# Altium project esb-25.PrjPcb
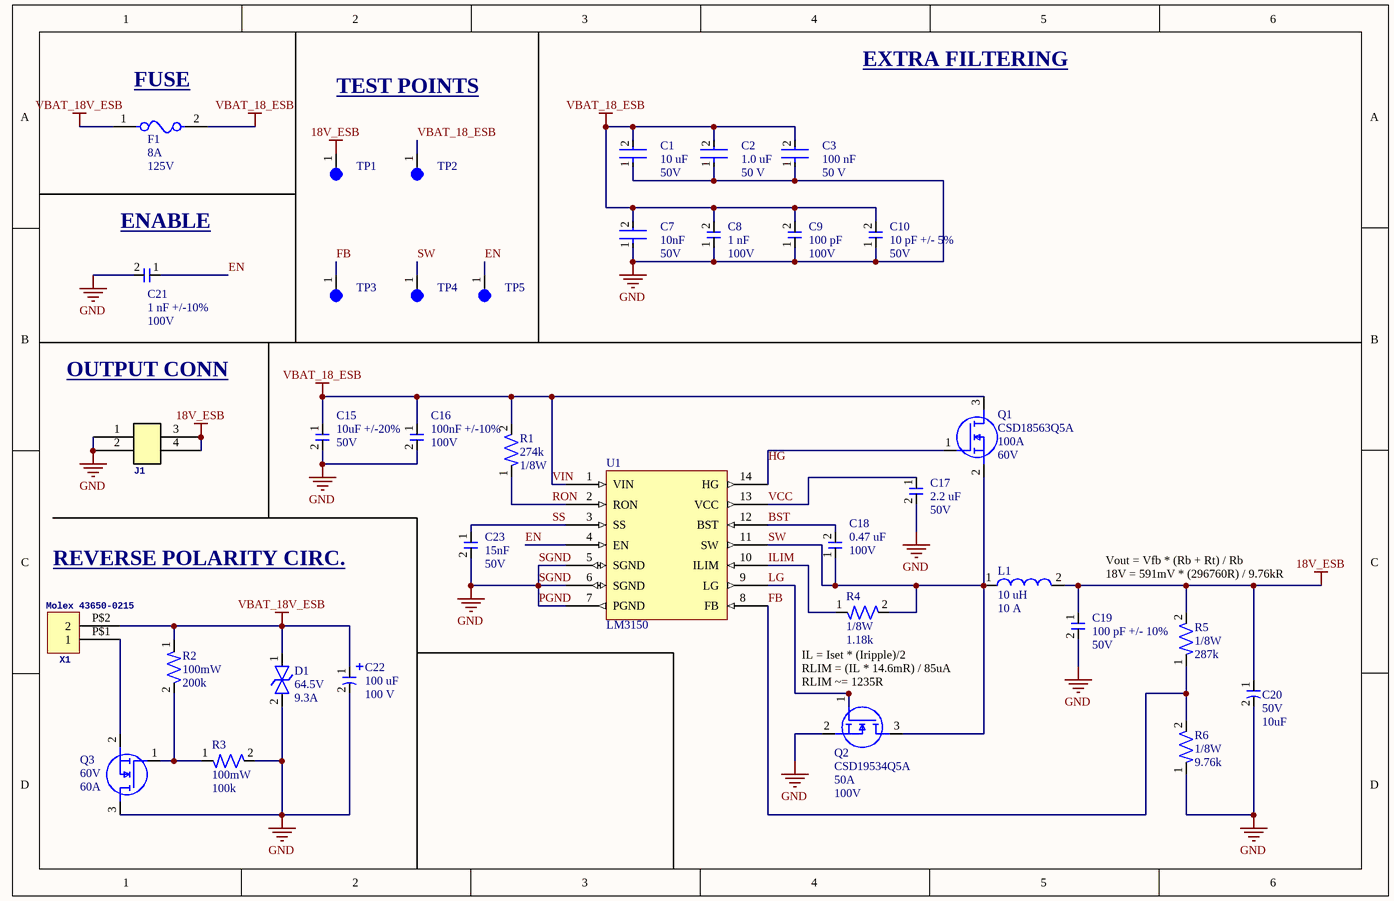
[diagram p0: 18V_ESB.SchDoc]
1 sheet, 36 parts. Net scope: global (net labels, ports and power ports of the same name join across sheets).
Board file: PCB1.PcbDoc

## Sheet 18V_ESB.SchDoc
size 259 x 167 mm; SheetNumber: 1; SheetTotal: 1

### Parts
C1  Voltage: 50V  Capacitance: 10 uF  [CAP-1210]  (hidden comment: CL32B106KBJNNNE)
C2  Voltage: 50 V  Capacitance: 1.0 uF  [CAP-0805]  (hidden comment: CC0805KKX7R9BB105)
C3  Voltage Rating: 50 V  Capacitance: 100 nF  [CAP-0805]  (hidden comment: CC0805KRX7R9BB104)
C7  Voltage: 50V  Capacitance: 10nF  [CAP-0805]  (hidden comment: GRM2195C1H103JA01D)
C8  Capacitance: 1 nF  Voltage Rating: 100V  [CAP-0805]  (hidden comment: CDR01BX102BKUS7185)
C9  Capacitance: 100 pF  Voltage: 100V  [CAP-0603]  (hidden comment: 0603N101J101CT)
C10  Capacitance: 10 pF +/- 5%  Voltage Rating: 50V  [CAP-0603]  (hidden comment: 0603N100J500CT)
C15  Capacitance: 10uF +/-20%  Voltage Rating: 50V  [CAP-1206]  (hidden comment: CL31B106KBHNNNE)
C16  Capacitance: 100nF +/-10%  Voltage Rating: 100V  [CAP-0603]  (hidden comment: CC0603KRX7R0BB104)
C17  Capacitance: 2.2 uF  oltage: 50V  [CAP-0603]  (hidden comment: UMK107BBJ225KA-T)
C18  Capacitance: 0.47 uF  Voltage: 100V  [CAP-0805]  (hidden comment: KAM21KR72A474KL)
C19  Capacitance: 100 pF +/- 10%  Voltage: 50V  [CAP-0402]  (hidden comment: 0402B101K500NT)
C20  Voltage: 50V  Capacitance: 10uF  [ELEC-10uF]  (hidden comment: EEE-FK1H100UR)
C21  Capacitance: 1 nF +/-10%  Voltage: 100V  [CAP-0603]  (hidden comment: C0603Y102K1RAC7867)
C22  Capacitance: 100 uF  Voltage: 100 V  [ELEC-100U-0001]  (hidden comment: 100SEV100M12.5X16)
C23  Parameter 1: 15nF  Parameter 2: 50V  [CAP-0402]  (hidden comment: CC0402JRX7R9BB153)
D1  Voltage Rating: 64.5V  Current Rating: 9.3A  [DO-214AA (SMBJ)]  (hidden comment: SMBJ40CA)
F1  Fuse Current: 8A  Voltage Rating: 125V  [FUSE-0001]  (hidden comment: 01550900M)
J1  Molex 43045-0412  [CONN-4POS-0002]  (value not drawn)
L1  Inductance: 10 uH  DCI: 10 A  [PWRIND-10U-0002]  (hidden comment: SRP1270-100M)
Q1  CSD18563Q5A  Id-Continuous: 100A  VDS-Max: 60V  [8-VSONP]
Q2  CSD19534Q5A  Id-Continuous: 50A  VDS-Max: 100V  [8-VSONP]
Q3  Voltage: 60V  Continuous Current: 60A  [IC-8VSONCLIP]  (hidden comment: CSD18543Q3AT)
R1  Resistance: 274k  Power: 1/8W  [RES-0805]  (hidden comment: RC0805FR-07274KL)
R2  Power: 100mW  Resistance: 200k  [RES-0603]  (hidden comment: RC0603FR-07200KL)
R3  Power: 100mW  Resistance: 100k  [RES-0603]  (hidden comment: RC0603FR-07100KL)
R4  Power: 1/8W  Resistance: 1.18k  [RES-0805]  (hidden comment: RC0805FR-071K18L)
R5  Power: 1/8W  Resistance: 287k  [RES-0805]  (hidden comment: RC0805FR-07287KL)
R6  Power: 1/8W  Resistance: 9.76k  [RES-0805]  (hidden comment: RC0805FR-079K76L)
TP1  5003  [TEST-POINT-0001]  (value not drawn)
TP2  5003  [TEST-POINT-0001]  (value not drawn)
TP3  5003  [TEST-POINT-0001]  (value not drawn)
TP4  5003  [TEST-POINT-0001]  (value not drawn)
TP5  5003  [TEST-POINT-0001]  (value not drawn)
U1  LM3150  [IC-14HTSSOP]
X1  Molex 43650-0215  [43650-0215]

### Nets
18V_ESB: C19.1 C20.1 J1.3 J1.4 L1.2 R5.2 TP1.1
PGND: C1.1 C2.1 C3.1 C7.1 C8.1 C9.1 C10.1 C15.2 C16.2 C17.2 C19.2 C20.2 C21.2 C22.2 C23.2 D1.2 J1.1 J1.2 Q2.2(S) Q3.3(D) R3.2 R6.1 U1.5(SGND) U1.6(SGND) U1.7(PGND)  [also labelled GND, SGND]
VBAT_18_ESB: C1.2 C2.2 C3.2 C7.2 C8.2 C9.2 C10.2 C15.1 C16.1 F1.2 Q1.3(D) R1.2 TP2.1 U1.1(VIN)  [also labelled VIN]
VBAT_18V_ESB: C22.1 D1.1 F1.1 R2.1 X1.P$2(2)
BST: C18.2 U1.12(BST)
EN: C21.1 TP5.1 U1.4(EN)
FB: R5.1 R6.2 TP3.1 U1.8(FB)
HG: Q1.1(G) U1.14(HG)
ILIM: R4.1 U1.10(ILIM)
LG: Q2.1(G) U1.9(LG)
RON: R1.1 U1.2(RON)
SS: C23.1 U1.3(SS)
SW: C18.1 L1.1 Q1.2(S) Q2.3(D) R4.2 TP4.1 U1.11(SW)
VCC: C17.1 U1.13(VCC)
NetQ3_1: Q3.1(G) R2.2 R3.1
NetQ3_2: Q3.2(S) X1.P$1(1)

### Notes on the sheet
- (near F1) FUSE
- TEST POINTS
- EXTRA FILTERING
- (near C21) ENABLE
- OUTPUT CONN
- REVERSE POLARITY CIRC.
- (near R5) Vout = Vfb * (Rb + Rt) / Rb
  18V = 591mV * (296760R) / 9.76kR
- (near Q2) IL = Iset * (Iripple)/2
  RLIM = (IL * 14.6mR) / 85uA
  RLIM ~= 1235R

### Library data of the parts
C1 = CAP-10U-0002: CAP CER 10UF 50V X7R 1210; Device Class: Ceramic; Size: 1210; ComponentLink1Description: Datasheet; ComponentLink1URL: https://mm.digikey.com/Volume0/opasdata/d220001/medias/docus/41/CL32B106KBJNNNE_Spec.pdf
C2 = CAP-1U-0001: CAP CER 1UF 50V X7R 0805; ComponentLink2URL: https://www.yageo.com/upload/media/product/productsearch/datasheet/mlcc/UPY-GPHC_X7R_6.3V-to-250V_24.pdf; ComponentLink2Description: Datasheet; Device Class: Ceramic; Size: 0805
C3 = CAP-0.1U-0002: CAP CER 0.1UF 50V X7R 0805; ComponentLink2Description: Datasheet; ComponentLink2URL: https://www.yageo.com/upload/media/product/productsearch/datasheet/mlcc/UPY-GPHC_X7R_6.3V-to-250V_24.pdf; Device Class: Ceramic; Size: 0805
C7 = CAP-10N-0001: CAP CER 10000PF 50V C0G/NP0 0805; Device Class: Ceramic; Size: 0805; ComponentLink1Description: Datasheet; ComponentLink1URL: https://search.murata.co.jp/Ceramy/image/img/A01X/G101/ENG/GRM2195C1H103JA01-01.pdf
C8 = CAP-1N-0003: 1000 pF ±10% 100V Ceramic Capacitor BX 0805 (2012 Metric); Package Size: 0805
C9 = CAP-100P-0002: 100 pF ±5% 100V Ceramic Capacitor C0G, NP0 0603 (1608 Metric); Tolerance: +/-5%; Temp Coeff: C0G/NP0; Package Size: 0603
C10 = CAP-10P-0001: 10 pF ±5% 50V Ceramic Capacitor C0G, NP0 0603 (1608 Metric); Manufacturer: Walshin Technology Corporation; Assembled?: Yes; Manufacturer Part Number: 0603N100J500CT; Temperature Coefficient: C0G, NP0; Package Size: 0603
C15 = CAP-10U-0001: 10 µF ±10% 50V Ceramic Capacitor X7R 1206 (3216 Metric); Manufacturer: Samsung Electro-Mechanics; Assembled?: no; Manufacturer Part Number: CL31B106KBHNNNE; Temperature Coefficient: X7R; Package Size: 1206
C16 = CAP-100N-0001: CAP CER 0.1UF 100V X7R 0603; Manufacturer: YAGEO; Assembled?: no; Manufacturer Part Number: CC0603KRX7R0BB104; Temperature Coefficient: X7R; Package Size: 0603
C17 = CAP-2.2U-0001: 2.2 µF ±10% 50V Ceramic Capacitor X5R 0603 (1608 Metric)
C18 = CAP-0.47U-0001: 0.47 µF ±10% 100V Ceramic Capacitor X7R 0805 (2012 Metric); Tolerance: +/- 10%; Assembled?: No; Temperature Coefficient: X7R; Package Size: 0805
C19 = CAP-100P-0001-JLC: 50V 100pF X7R ±10% 0402 Multilayer Ceramic Capacitors MLCC - SMD/SMT ROHS; assembled?: yes; JLC part number: C2991538
C20 = ELEC-10U-0001: 10 µF 50 V Aluminum Electrolytic Capacitors Radial, Can - SMD 2000 Hrs @ 105°C; Manufacturer Part Number: RC0402FR-074K7P; Manufacturer: YAGEO; Assembled?: no; Package Size: 0402
C21 = CAP-1N-0001: 1000 pF ±10% 100V Ceramic Capacitor X7R 0603 (1608 Metric)
C22 = ELEC-100U-0001: 100 µF 100 V Aluminum Electrolytic Capacitors Radial, Can - SMD 2000 Hrs @ 85°C; Manufacturer: Rubycon; Tolerance: +/- 20%; Assembled?: No; ESR: idk check the datasheet i couldnt find it
C23 = CAP-15N-0001: CAP CER 0.015UF 50V X7R 0402
D1 = DIO-TVS-0001: TVS DIODE 40VWM 64.5VC DO214AA; ComponentLink1Description: Datasheet; ComponentLink1URL: https://www.littelfuse.com/media?resourcetype=datasheets&itemid=09a6ae9a-73cb-4ac4-acac-e6dab92ab953&filename=littelfuse_tvs_diode_smbj_datasheet.pdf
F1 = FUSE-0001: FUSE BLOK CARTRIDGE 125V 10A SMD; ComponentLink2Description: Datasheet; ComponentLink2URL: https://www.littelfuse.com/~/media/electronics/datasheets/fuses/littelfuse_fuse_154_154t_154l_154tl_datasheet.pdf.pdf
J1 = CONN-4POS-0002: CONN HEADER VERT 4POS 3MM; ComponentLink1Description: Datasheet; ComponentLink1URL: https://www.molex.com/content/dam/molex/molex-dot-com/products/automated/en-us/salesdrawingpdf/430/43045/430450412_sd.pdf?inline
L1 = PWRIND-10U-0002: 10 µH Shielded Drum Core, Wirewound Inductor 10 A 16.8mOhm Max Nonstandard; Tolerance: +/- 20%; Isat: 16A; Assembled?: No; DCR: 16.8 mOhm
Q1 = NMOS-100A-0001: MOSFET N-CH 60V 100A 8VSON; Manufacturer Part Number: T2N7002AK,LM; Manufacturer: Toshiba; FET type: N-Channel; Rds On-Max: 3.9Ohm; Vgs-Max: 20V; Assembled?: no; Package: SOT-23-3
Q2 = NMOS-50A-0001: MOSFET N-CH 100V 50A 8VSON; Manufacturer Part Number: T2N7002AK,LM; Manufacturer: Toshiba; FET type: N-Channel; Rds On-Max: 3.9Ohm; Vgs-Max: 20V; Assembled?: no; Package: SOT-23-3
Q3 = NMOS-60A-0001: MOSFET N-CH 60V 12A/60A 8VSON; ComponentLink2Description: Datasheet; ComponentLink2URL: http://www.ti.com/lit/ds/symlink/csd18543q3a.pdf
R1 = RES-274k-0001: 274 kOhms ±1% 0.125W, 1/8W Chip Resistor 0805 (2012 Metric) Moisture Resistant Thick Film
R2 = RES-200k-0001: RES SMD 200K OHM 1% 1/10W 0603; Tolerance: 1%; Size: 0603; ComponentLink1Description: Datasheet; ComponentLink1URL: https://www.yageo.com/upload/media/product/products/datasheet/rchip/PYu-RC_Group_51_RoHS_L_12.pdf
R3 = RES-100k-0001: RES SMD 100K OHM 1% 1/10W 0603; Tolerance: 1%; Size: 0603; ComponentLink1Description: Datasheet; ComponentLink1URL: https://www.yageo.com/upload/media/product/products/datasheet/rchip/PYu-RC_Group_51_RoHS_L_12.pdf
R4 = RES-1.18k-0001: 1.18 kOhms ±1% 0.125W, 1/8W Chip Resistor 0805 (2012 Metric) Moisture Resistant Thick Film
R5 = RES-287k-0001: 287 kOhms ±1% 0.125W, 1/8W Chip Resistor 0805 (2012 Metric) Moisture Resistant Thick Film
R6 = RES-9.76k-0001: 9.76 kOhms ±1% 0.125W, 1/8W Chip Resistor 0805 (2012 Metric) Moisture Resistant Thick Film
TP1-TP5 = TEST-POINT-0001: Oranange PC Test Point, Miniature Phoisphor Bronze Silver Plating Through Hole Mounting Type
U1 = IC-ESB-0001: Buck Regulator Positive Output Step-Down DC-DC Controller IC 14-HTSSOP
X1 = Micro-Fit Molex 2 Pin Vertical: GateName_1: G$1; SymbolName_1: HEADER_POS2; DeviceSetName: HEADER_POS2_?; DeviceName: 43650-0215; LibraryName: con-molex-micro-fit-3_0_2; Package: 43650-0215